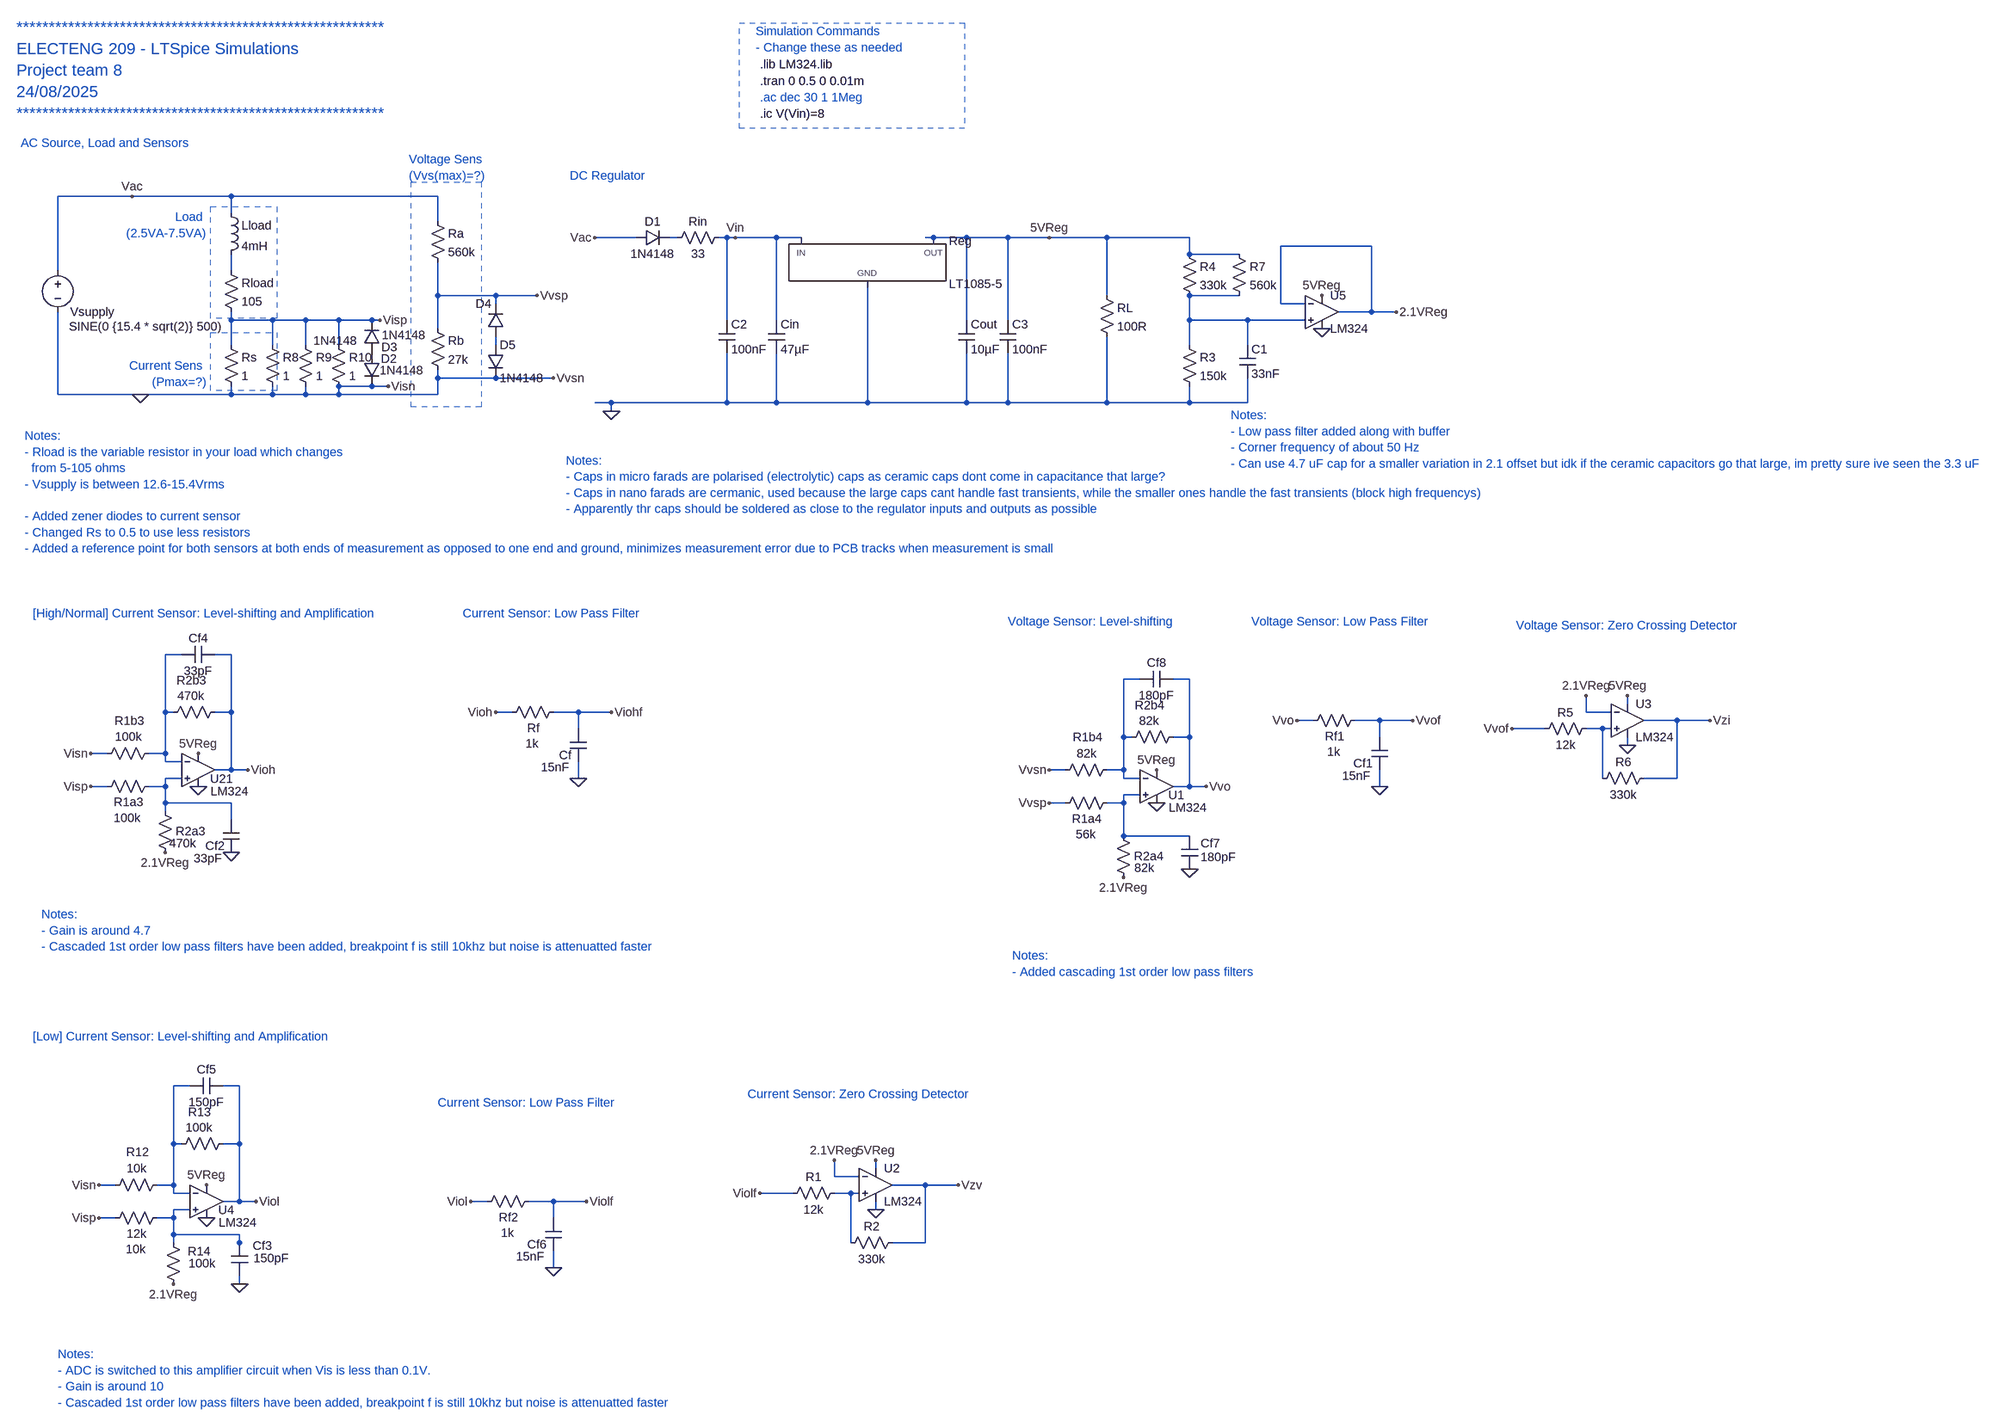
[diagram p0: schematic Project_Model_Revised.asc]
Project_Model_Revised.asc, the LTspice schematic file:
Version 4
SHEET 1 3152 2980
WIRE -560 112 -704 112
WIRE -368 112 -560 112
WIRE 32 112 -368 112
WIRE -368 144 -368 112
WIRE 32 160 32 112
WIRE 416 192 336 192
WIRE 496 192 480 192
WIRE 592 192 576 192
WIRE 608 192 592 192
WIRE 688 192 608 192
WIRE 736 192 688 192
WIRE 992 192 976 192
WIRE 1056 192 992 192
WIRE 1136 192 1056 192
WIRE 1216 192 1136 192
WIRE 1328 192 1216 192
WIRE 1488 192 1328 192
WIRE 1840 208 1664 208
WIRE 1488 224 1488 192
WIRE 1584 224 1488 224
WIRE -704 256 -704 112
WIRE -368 256 -368 224
WIRE 32 304 32 240
WIRE 144 304 32 304
WIRE 224 304 144 304
WIRE 1328 304 1328 192
WIRE 1584 304 1488 304
WIRE 144 320 144 304
WIRE 1664 320 1664 208
WIRE 1712 320 1664 320
WIRE 1840 336 1840 208
WIRE 1840 336 1776 336
WIRE 1888 336 1840 336
WIRE -368 352 -368 336
WIRE -288 352 -368 352
WIRE -224 352 -288 352
WIRE -160 352 -224 352
WIRE -96 352 -160 352
WIRE -80 352 -96 352
WIRE 592 352 592 192
WIRE 688 352 688 192
WIRE 1056 352 1056 192
WIRE 1136 352 1136 192
WIRE 1488 352 1488 304
WIRE 1600 352 1488 352
WIRE 1712 352 1600 352
WIRE 32 368 32 304
WIRE -368 400 -368 352
WIRE -288 400 -288 352
WIRE -224 400 -224 352
WIRE -160 400 -160 352
WIRE 144 400 144 384
WIRE 1488 400 1488 352
WIRE 1600 400 1600 352
WIRE 32 464 32 448
WIRE 144 464 32 464
WIRE 256 464 144 464
WIRE -96 480 -160 480
WIRE -64 480 -96 480
WIRE -704 496 -704 336
WIRE -544 496 -704 496
WIRE -368 496 -368 480
WIRE -368 496 -544 496
WIRE -288 496 -368 496
WIRE -288 496 -288 480
WIRE -224 496 -224 480
WIRE -224 496 -288 496
WIRE -160 496 -160 480
WIRE -160 496 -224 496
WIRE 32 496 32 464
WIRE 32 496 -160 496
WIRE 368 512 336 512
WIRE 592 512 592 416
WIRE 592 512 368 512
WIRE 688 512 688 416
WIRE 688 512 592 512
WIRE 864 512 864 288
WIRE 864 512 688 512
WIRE 1056 512 1056 416
WIRE 1056 512 864 512
WIRE 1136 512 1136 416
WIRE 1136 512 1056 512
WIRE 1328 512 1328 384
WIRE 1328 512 1136 512
WIRE 1488 512 1488 480
WIRE 1488 512 1328 512
WIRE 1600 512 1600 464
WIRE 1600 512 1488 512
WIRE 368 528 368 512
WIRE -464 1008 -496 1008
WIRE -368 1008 -400 1008
WIRE 1392 1056 1360 1056
WIRE 1488 1056 1456 1056
WIRE 2336 1104 2336 1088
WIRE -496 1120 -496 1008
WIRE -480 1120 -496 1120
WIRE -368 1120 -368 1008
WIRE -368 1120 -400 1120
WIRE 176 1120 144 1120
WIRE 304 1120 256 1120
WIRE 368 1120 304 1120
WIRE 2256 1120 2256 1088
WIRE 2304 1120 2256 1120
WIRE 1728 1136 1696 1136
WIRE 1856 1136 1808 1136
WIRE 1920 1136 1856 1136
WIRE 2432 1136 2368 1136
WIRE 2496 1136 2432 1136
WIRE 304 1152 304 1120
WIRE 2176 1152 2112 1152
WIRE 2288 1152 2256 1152
WIRE 2304 1152 2288 1152
WIRE 1360 1168 1360 1056
WIRE 1376 1168 1360 1168
WIRE 1488 1168 1488 1056
WIRE 1488 1168 1456 1168
WIRE 1856 1168 1856 1136
WIRE 2336 1184 2336 1168
WIRE -608 1200 -640 1200
WIRE -496 1200 -496 1120
WIRE -496 1200 -528 1200
WIRE -496 1216 -496 1200
WIRE -464 1216 -496 1216
WIRE -368 1232 -368 1120
WIRE -368 1232 -400 1232
WIRE -336 1232 -368 1232
WIRE 1248 1232 1216 1232
WIRE 1360 1232 1360 1168
WIRE 1360 1232 1328 1232
WIRE -464 1248 -496 1248
WIRE 304 1248 304 1216
WIRE 1360 1248 1360 1232
WIRE 1392 1248 1360 1248
WIRE 2288 1248 2288 1152
WIRE 2432 1248 2432 1136
WIRE 2432 1248 2368 1248
WIRE -608 1264 -640 1264
WIRE -496 1264 -496 1248
WIRE -496 1264 -528 1264
WIRE 1488 1264 1488 1168
WIRE 1488 1264 1456 1264
WIRE 1520 1264 1488 1264
WIRE 1856 1264 1856 1232
WIRE 1392 1280 1360 1280
WIRE -496 1296 -496 1264
WIRE -368 1296 -496 1296
WIRE 1248 1296 1216 1296
WIRE 1360 1296 1360 1280
WIRE 1360 1296 1328 1296
WIRE -496 1312 -496 1296
WIRE -368 1328 -368 1296
WIRE 1360 1360 1360 1296
WIRE 1488 1360 1360 1360
WIRE -448 1856 -480 1856
WIRE -352 1856 -384 1856
WIRE -480 1968 -480 1856
WIRE -464 1968 -480 1968
WIRE -352 1968 -352 1856
WIRE -352 1968 -384 1968
WIRE 880 2016 880 2000
WIRE 800 2032 800 2000
WIRE 848 2032 800 2032
WIRE -592 2048 -624 2048
WIRE -480 2048 -480 1968
WIRE -480 2048 -512 2048
WIRE 976 2048 912 2048
WIRE 1040 2048 976 2048
WIRE -480 2064 -480 2048
WIRE -448 2064 -480 2064
WIRE 720 2064 656 2064
WIRE 832 2064 800 2064
WIRE 848 2064 832 2064
WIRE -352 2080 -352 1968
WIRE -352 2080 -384 2080
WIRE -320 2080 -352 2080
WIRE 128 2080 96 2080
WIRE 256 2080 208 2080
WIRE 320 2080 256 2080
WIRE -448 2096 -480 2096
WIRE 880 2096 880 2080
WIRE -592 2112 -624 2112
WIRE -480 2112 -480 2096
WIRE -480 2112 -512 2112
WIRE 256 2112 256 2080
WIRE -480 2144 -480 2112
WIRE -352 2144 -480 2144
WIRE -480 2160 -480 2144
WIRE -352 2160 -352 2144
WIRE 832 2160 832 2064
WIRE 976 2160 976 2048
WIRE 976 2160 912 2160
WIRE -352 2176 -352 2160
WIRE 256 2208 256 2176
WIRE -352 2240 -352 2224
FLAG -544 496 0
FLAG -560 112 Vac
FLAG 368 528 0
FLAG -80 352 Visp
FLAG 224 304 Vvsp
FLAG -432 1264 0
FLAG -432 1200 5VReg
FLAG -640 1264 Visp
FLAG -336 1232 Vioh
FLAG 1424 1296 0
FLAG 1424 1232 5VReg
FLAG 1216 1296 Vvsp
FLAG 1216 1232 Vvsn
FLAG 1520 1264 Vvo
FLAG 336 192 Vac
FLAG 1216 192 5VReg
FLAG 304 1248 0
FLAG 144 1120 Vioh
FLAG 368 1120 Viohf
FLAG 608 192 Vin
FLAG 880 2000 5VReg
FLAG 1856 1264 0
FLAG 1696 1136 Vvo
FLAG 1920 1136 Vvof
FLAG 2336 1088 5VReg
FLAG 656 2064 Violf
FLAG 2112 1152 Vvof
FLAG 1040 2048 Vzv
FLAG 2496 1136 Vzi
FLAG -496 1392 2.1VReg
FLAG 1360 1440 2.1VReg
FLAG 880 2096 0
FLAG 2336 1184 0
FLAG 800 2000 2.1VReg
FLAG 2256 1088 2.1VReg
FLAG 1888 336 2.1VReg
FLAG 1744 304 5VReg
FLAG 1744 368 0
FLAG -368 1392 0
FLAG -416 2112 0
FLAG -416 2048 5VReg
FLAG -624 2112 Visp
FLAG -320 2080 Viol
FLAG -480 2240 2.1VReg
FLAG -352 2240 0
FLAG 256 2208 0
FLAG 96 2080 Viol
FLAG 320 2080 Violf
FLAG 1488 1424 0
FLAG -64 480 Visn
FLAG -640 1200 Visn
FLAG -624 2048 Visn
FLAG 256 464 Vvsn
SYMBOL voltage -704 240 R0
WINDOW 0 24 96 Left 2
WINDOW 3 22 124 Left 2
WINDOW 123 0 0 Left 0
WINDOW 39 0 0 Left 0
SYMATTR InstName Vsupply
SYMATTR Value SINE(0 {15.4 * sqrt(2)} 500)
SYMBOL PowerProducts/LT1085-5 864 192 R0
SYMATTR InstName Reg
SYMBOL res 1312 288 R0
SYMATTR InstName RL
SYMATTR Value 100R
SYMBOL res 592 176 R90
WINDOW 0 0 56 VBottom 2
WINDOW 3 32 56 VTop 2
SYMATTR InstName Rin
SYMATTR Value 33
SYMBOL diode 416 208 R270
WINDOW 0 32 32 VTop 2
WINDOW 3 0 32 VBottom 2
SYMATTR InstName D1
SYMATTR Value 1N4148
SYMBOL cap 672 352 R0
SYMATTR InstName Cin
SYMATTR Value 47µF
SYMATTR SpiceLine Rser=0.001
SYMBOL cap 1040 352 R0
SYMATTR InstName Cout
SYMATTR Value 10µF
SYMATTR SpiceLine Rser=0.001
SYMBOL res -384 240 R0
SYMATTR InstName Rload
SYMATTR Value 105
SYMBOL ind -384 128 R0
SYMATTR InstName Lload
SYMATTR Value 4mH
SYMBOL res -384 384 R0
SYMATTR InstName Rs
SYMATTR Value 1
SYMBOL res 16 144 R0
SYMATTR InstName Ra
SYMATTR Value 560k
SYMBOL res 16 352 R0
SYMATTR InstName Rb
SYMATTR Value 27k
SYMBOL Opamps/opamp2 -432 1168 R0
WINDOW 0 23 81 Left 2
WINDOW 3 24 105 Left 2
SYMATTR InstName U21
SYMATTR Value LM324
SYMBOL res -512 1248 R90
WINDOW 0 62 55 VBottom 2
WINDOW 3 61 57 VTop 2
SYMATTR InstName R1a3
SYMATTR Value 100k
SYMBOL res -512 1184 R90
WINDOW 0 -32 53 VBottom 2
WINDOW 3 -32 55 VTop 2
SYMATTR InstName R1b3
SYMATTR Value 100k
SYMBOL res -384 1104 R90
WINDOW 0 -30 61 VBottom 2
WINDOW 3 -31 62 VTop 2
SYMATTR InstName R2b3
SYMATTR Value 470k
SYMBOL res -480 1408 R180
WINDOW 0 -62 57 Left 2
WINDOW 3 -44 34 Left 2
SYMATTR InstName R2a3
SYMATTR Value 470k
SYMBOL Opamps/opamp2 1424 1200 R0
WINDOW 0 23 81 Left 2
WINDOW 3 24 105 Left 2
SYMATTR InstName U1
SYMATTR Value LM324
SYMBOL res 1344 1280 R90
WINDOW 0 62 55 VBottom 2
WINDOW 3 61 57 VTop 2
SYMATTR InstName R1a4
SYMATTR Value 56k
SYMBOL res 1344 1216 R90
WINDOW 0 -32 53 VBottom 2
WINDOW 3 -32 55 VTop 2
SYMATTR InstName R1b4
SYMATTR Value 82k
SYMBOL res 1472 1152 R90
WINDOW 0 -30 61 VBottom 2
WINDOW 3 -31 62 VTop 2
SYMATTR InstName R2b4
SYMATTR Value 82k
SYMBOL res 1376 1456 R180
WINDOW 0 -62 57 Left 2
WINDOW 3 -44 34 Left 2
SYMATTR InstName R2a4
SYMATTR Value 82k
SYMBOL res 272 1104 R90
WINDOW 0 62 55 VBottom 2
WINDOW 3 61 57 VTop 2
SYMATTR InstName Rf
SYMATTR Value 1k
SYMBOL cap 320 1216 R180
WINDOW 0 29 13 Left 2
WINDOW 3 33 -11 Left 2
SYMATTR InstName Cf
SYMATTR Value 15nF
SYMBOL opamp2 880 1984 R0
SYMATTR InstName U2
SYMATTR Value LM324
SYMBOL res 816 2048 R90
WINDOW 0 0 56 VBottom 2
WINDOW 3 32 56 VTop 2
SYMATTR InstName R1
SYMATTR Value 12k
SYMBOL res 928 2144 R90
WINDOW 0 0 56 VBottom 2
WINDOW 3 32 56 VTop 2
SYMATTR InstName R2
SYMATTR Value 330k
SYMBOL res 1472 384 R0
SYMATTR InstName R3
SYMATTR Value 150k
SYMBOL res 1472 208 R0
SYMATTR InstName R4
SYMATTR Value 330k
SYMBOL res 1824 1120 R90
WINDOW 0 62 55 VBottom 2
WINDOW 3 61 57 VTop 2
SYMATTR InstName Rf1
SYMATTR Value 1k
SYMBOL cap 1872 1232 R180
WINDOW 0 29 13 Left 2
WINDOW 3 33 -11 Left 2
SYMATTR InstName Cf1
SYMATTR Value 15nF
SYMBOL opamp2 2336 1072 R0
SYMATTR InstName U3
SYMATTR Value LM324
SYMBOL res 2272 1136 R90
WINDOW 0 0 56 VBottom 2
WINDOW 3 32 56 VTop 2
SYMATTR InstName R5
SYMATTR Value 12k
SYMBOL res 2384 1232 R90
WINDOW 0 0 56 VBottom 2
WINDOW 3 32 56 VTop 2
SYMATTR InstName R6
SYMATTR Value 330k
SYMBOL diode 160 384 R180
WINDOW 0 24 64 Left 2
WINDOW 3 152 3 Left 2
SYMATTR InstName D4
SYMATTR Value 1N4148
SYMBOL diode 128 400 R0
SYMATTR InstName D5
SYMATTR Value 1N4148
SYMBOL res 1568 208 R0
SYMATTR InstName R7
SYMATTR Value 560k
SYMBOL cap 1584 400 R0
SYMATTR InstName C1
SYMATTR Value 33nF
SYMBOL opamp2 1744 272 R0
SYMATTR InstName U5
SYMATTR Value LM324
SYMBOL res -304 384 R0
SYMATTR InstName R8
SYMATTR Value 1
SYMBOL cap -352 1392 R180
WINDOW 0 29 13 Left 2
WINDOW 3 33 -11 Left 2
SYMATTR InstName Cf2
SYMATTR Value 33pF
SYMBOL cap -464 1024 R270
WINDOW 0 32 32 VTop 2
WINDOW 3 0 32 VBottom 2
SYMATTR InstName Cf4
SYMATTR Value 33pF
SYMBOL Opamps/opamp2 -416 2016 R0
WINDOW 0 23 81 Left 2
WINDOW 3 24 105 Left 2
SYMATTR InstName U4
SYMATTR Value LM324
SYMBOL res -496 2096 R90
WINDOW 0 62 55 VBottom 2
WINDOW 3 61 57 VTop 2
SYMATTR InstName 12k
SYMATTR Value 10k
SYMBOL res -496 2032 R90
WINDOW 0 -32 53 VBottom 2
WINDOW 3 -32 55 VTop 2
SYMATTR InstName R12
SYMATTR Value 10k
SYMBOL res -368 1952 R90
WINDOW 0 -30 61 VBottom 2
WINDOW 3 -31 62 VTop 2
SYMATTR InstName R13
SYMATTR Value 100k
SYMBOL res -464 2256 R180
WINDOW 0 -56 79 Left 2
WINDOW 3 -66 56 Left 2
SYMATTR InstName R14
SYMATTR Value 100k
SYMBOL cap -336 2224 R180
WINDOW 0 -47 58 Left 2
WINDOW 3 -80 34 Left 2
SYMATTR InstName Cf3
SYMATTR Value 150pF
SYMBOL cap -448 1872 R270
WINDOW 0 32 32 VTop 2
WINDOW 3 0 32 VBottom 2
SYMATTR InstName Cf5
SYMATTR Value 150pF
SYMBOL res 224 2064 R90
WINDOW 0 62 55 VBottom 2
WINDOW 3 61 57 VTop 2
SYMATTR InstName Rf2
SYMATTR Value 1k
SYMBOL cap 272 2176 R180
WINDOW 0 29 13 Left 2
WINDOW 3 33 -11 Left 2
SYMATTR InstName Cf6
SYMATTR Value 15nF
SYMBOL cap 1504 1424 R180
WINDOW 0 -43 50 Left 2
WINDOW 3 -74 23 Left 2
SYMATTR InstName Cf7
SYMATTR Value 180pF
SYMBOL cap 1392 1072 R270
WINDOW 0 32 32 VTop 2
WINDOW 3 0 32 VBottom 2
SYMATTR InstName Cf8
SYMATTR Value 180pF
SYMBOL diode -80 416 R180
WINDOW 0 -33 -11 Left 2
WINDOW 3 44 24 Left 2
SYMATTR InstName D2
SYMATTR Value 1N4148
SYMBOL diode -112 416 R0
WINDOW 0 35 -12 Left 2
WINDOW 3 31 33 Left 2
SYMATTR InstName D3
SYMATTR Value 1N4148
SYMBOL cap 576 352 R0
SYMATTR InstName C2
SYMATTR Value 100nF
SYMBOL cap 1120 352 R0
SYMATTR InstName C3
SYMATTR Value 100nF
SYMBOL res -240 384 R0
SYMATTR InstName R9
SYMATTR Value 1
SYMBOL res -176 384 R0
SYMATTR InstName R10
SYMATTR Value 1
TEXT 656 -80 Left 2 ;.ac dec 30 1 1Meg
TEXT 656 -144 Left 2 !.lib LM324.lib
TEXT -784 -216 Left 3 ;*********************************************************\nELECTENG 209 - LTSpice Simulations\nProject team 8\n24/08/2025\n*********************************************************
TEXT -776 8 Left 2 ;AC Source, Load and Sensors
TEXT -768 576 Left 2 ;Notes: \n- Rload is the variable resistor in your load which changes \n  from 5-105 ohms \n- Vsupply is between 12.6-15.4Vrms\n \n- Added zener diodes to current sensor\n- Changed Rs to 0.5 to use less resistors\n- Added a reference point for both sensors at both ends of measurement as opposed to one end and ground, minimizes measurement error due to PCB tracks when measurement is small
TEXT -416 152 Right 2 ;Load \n(2.5VA-7.5VA)
TEXT -416 440 Right 2 ;Current Sens \n(Pmax=?)
TEXT -24 40 Left 2 ;Voltage Sens\n(Vvs(max)=?)
TEXT 648 -208 Left 2 ;Simulation Commands\n- Change these as needed
TEXT -752 928 Left 2 ;[High/Normal] Current Sensor: Level-shifting and Amplification
TEXT 1136 944 Left 2 ;Voltage Sensor: Level-shifting
TEXT 288 72 Left 2 ;DC Regulator
TEXT 656 -112 Left 2 !.tran 0 0.5 0 0.01m
TEXT 656 -48 Left 2 !.ic V(Vin)=8
TEXT 80 928 Left 2 ;Current Sensor: Low Pass Filter
TEXT 1608 944 Left 2 ;Voltage Sensor: Low Pass Filter
TEXT 632 1872 Left 2 ;Current Sensor: Zero Crossing Detector
TEXT 2120 952 Left 2 ;Voltage Sensor: Zero Crossing Detector
TEXT -752 1760 Left 2 ;[Low] Current Sensor: Level-shifting and Amplification
TEXT 32 1888 Left 2 ;Current Sensor: Low Pass Filter
TEXT -704 2376 Left 2 ;Notes:\n- ADC is switched to this amplifier circuit when Vis is less than 0.1V.\n- Gain is around 10\n- Cascaded 1st order low pass filters have been added, breakpoint f is still 10khz but noise is attenuatted faster
TEXT -736 1512 Left 2 ;Notes:\n- Gain is around 4.7\n- Cascaded 1st order low pass filters have been added, breakpoint f is still 10khz but noise is attenuatted faster
TEXT 1568 536 Left 2 ;Notes:\n- Low pass filter added along with buffer\n- Corner frequency of about 50 Hz\n- Can use 4.7 uF cap for a smaller variation in 2.1 offset but idk if the ceramic capacitors go that large, im pretty sure ive seen the 3.3 uF
TEXT 1144 1592 Left 2 ;Notes:\n- Added cascading 1st order low pass filters
TEXT 280 624 Left 2 ;Notes:\n- Caps in micro farads are polarised (electrolytic) caps as ceramic caps dont come in capacitance that large?\n- Caps in nano farads are cermanic, used because the large caps cant handle fast transients, while the smaller ones handle the fast transients (block high frequencys)\n- Apparently thr caps should be soldered as close to the regulator inputs and outputs as possible
RECTANGLE Normal -408 132 -280 348 2
RECTANGLE Normal -408 376 -280 488 2
RECTANGLE Normal -20 84 116 520 2
RECTANGLE Normal 616 -224 1052 -20 2

The netlist it stands for:
* Project_Model_Revised.asc
Vsupply Vac 0 SINE(0 {15.4 * sqrt(2)} 500)
XReg 0 5VReg Vin LT1085-5  ; pins GND OUT IN
RL 5VReg 0 100R
Rin Vin N001 33
D1 Vac N001 1N4148
Cin Vin 0 47µF Rser=0.001
Cout 5VReg 0 10µF Rser=0.001
Rload N002 Visp 105
Lload Vac N002 4mH
Rs Visp 0 1
Ra Vac Vvsp 560k
Rb Vvsp 0 27k
XU21 N008 N005 5VReg 0 Vioh LM324  ; pins In+ In- V+ V- OUT
R1a3 N008 Visp 100k
R1b3 N005 0 100k
R2b3 Vioh N005 470k
R2a3 2.1VReg N008 470k
XU1 N009 N006 5VReg 0 Vvo LM324  ; pins In+ In- V+ V- OUT
R1a4 N009 Vvsp 56k
R1b4 N006 0 82k
R2b4 Vvo N006 82k
R2a4 2.1VReg N009 82k
Rf Viohf Vioh 1k
Cf 0 Viohf 15nF
XU2 N011 2.1VReg 5VReg 0 Vzv LM324  ; pins In+ In- V+ V- OUT
R1 N011 Violf 12k
R2 Vzv N011 330k
R3 N003 0 150k
R4 5VReg N003 330k
Rf1 Vvof Vvo 1k
Cf1 0 Vvof 15nF
XU3 N007 2.1VReg 5VReg 0 Vzi LM324  ; pins In+ In- V+ V- OUT
R5 N007 Vvof 12k
R6 Vzi N007 330k
D4 N004 Vvsp 1N4148
D5 N004 0 1N4148
R7 5VReg N003 560k
C1 N003 0 33nF
XU5 N003 2.1VReg 5VReg 0 2.1VReg LM324  ; pins In+ In- V+ V- OUT
R8 Visp 0 1
Cf2 0 N008 33pF
Cf4 N005 Vioh 33pF
XU4 N012 N010 5VReg 0 Viol LM324  ; pins In+ In- V+ V- OUT
R§12k N012 Visp 10k
R12 N010 0 10k
R13 Viol N010 100k
R14 2.1VReg N012 100k
Cf3 0 N012 150pF
Cf5 N010 Viol 150pF
Rf2 Violf Viol 1k
Cf6 0 Violf 15nF
Cf7 0 N009 180pF
Cf8 N006 Vvo 180pF
D2 P001 Visp 1N4148
D3 P001 0 1N4148
C2 Vin 0 100nF
C3 5VReg 0 100nF
R9 Visp 0 1
R10 Visp 0 1
.model D D
.lib standard.dio
* .ac dec 30 1 1Meg
.lib LM324.lib
* *********************************************************
* ELECTENG 209 - LTSpice Simulations
* Project team 8
* 24/08/2025
* *********************************************************
* AC Source, Load and Sensors
* Notes:
* - Rload is the variable resistor in your load which changes
*   from 5-105 ohms
* - Vsupply is between 12.6-15.4Vrms
* - Added zener diodes to current sensor
* - Changed Rs to 0.5 to use less resistors
* - Added a reference point for both sensors at both ends of measurement as opposed to one end and ground, minimizes measurement error due to PCB tracks when measurement is small
* Load
* (2.5VA-7.5VA)
* Current Sens
* (Pmax=?)
* Voltage Sens
* (Vvs(max)=?)
* Simulation Commands
* - Change these as needed
* [High/Normal] Current Sensor: Level-shifting and Amplification
* Voltage Sensor: Level-shifting
* DC Regulator
.tran 0 0.5 0 0.01m
.ic V(Vin)=8
* Current Sensor: Low Pass Filter
* Voltage Sensor: Low Pass Filter
* Current Sensor: Zero Crossing Detector
* Voltage Sensor: Zero Crossing Detector
* [Low] Current Sensor: Level-shifting and Amplification
* Current Sensor: Low Pass Filter
* Notes:
* - ADC is switched to this amplifier circuit when Vis is less than 0.1V.
* - Gain is around 10
* - Cascaded 1st order low pass filters have been added, breakpoint f is still 10khz but noise is attenuatted faster
* Notes:
* - Gain is around 4.7
* - Cascaded 1st order low pass filters have been added, breakpoint f is still 10khz but noise is attenuatted faster
* Notes:
* - Low pass filter added along with buffer
* - Corner frequency of about 50 Hz
* - Can use 4.7 uF cap for a smaller variation in 2.1 offset but idk if the ceramic capacitors go that large, im pretty sure ive seen the 3.3 uF
* Notes:
* - Added cascading 1st order low pass filters
* Notes:
* - Caps in micro farads are polarised (electrolytic) caps as ceramic caps dont come in capacitance that large?
* - Caps in nano farads are cermanic, used because the large caps cant handle fast transients, while the smaller ones handle the fast transients (block high frequencys)
* - Apparently thr caps should be soldered as close to the regulator inputs and outputs as possible
.backanno
.end